# Altium schematic sheet Low_Pass_48kHz.SchDoc: Wprowadź Tytuł
size A4; CheckedBy: Wprowadź sprawdzającego; CompanyName: Politechnika Warszawska; DrawnBy: Wprowadź autora; Organization: Koło Naukowe Robotyków; Address1: Nowowiejska 24; Address2: 00-001; Address3: Warszawa; Address4: Polska; Revision: V*.*; DrawnDate: 10.10.20; CheckDate: 10.10.20; ProjectName: Nazwa Projektu
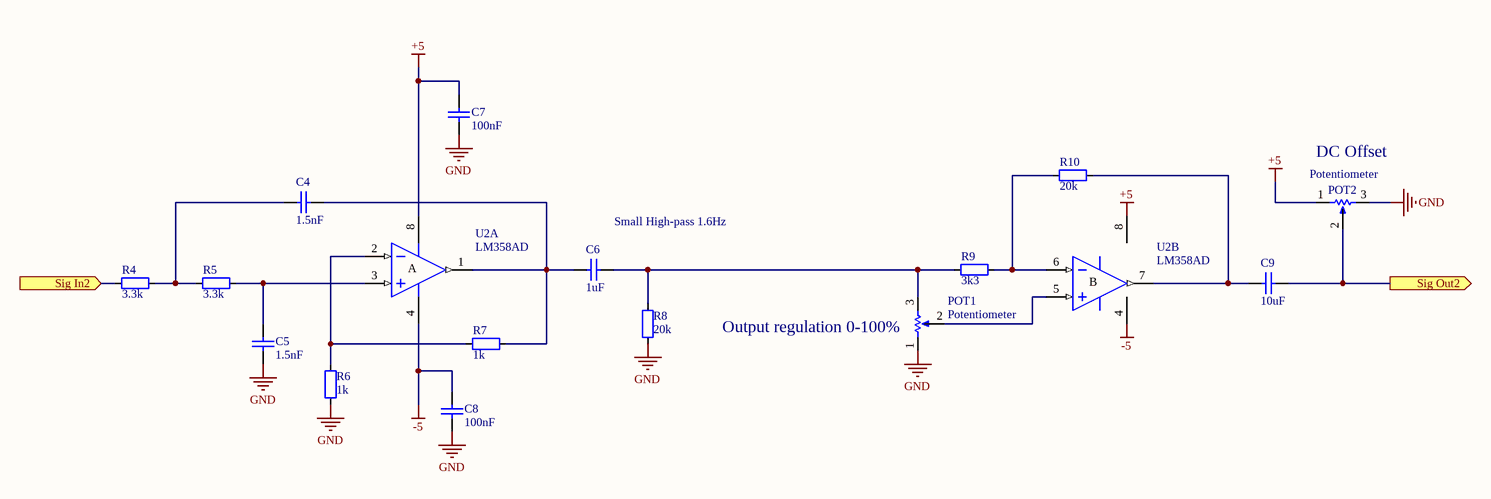
[diagram p0: Low_Pass_48kHz.SchDoc]

## Parts
C4  value 1.5nF  [CAPC0603M]  (hidden comment: Cap)
C5  value 1.5nF  [CAPC0603M]  (hidden comment: Cap)
C6  value 1uF  [CAPC0603M]  (hidden comment: Cap)
C7  value 100nF  [CAPC0603M]  (hidden comment: Cap)
C8  value 100nF  [CAPC0603M]  (hidden comment: Cap)
C9  value 10uF  [CAPC0603M]  (hidden comment: Cap)
POT1  Potentiometer  [Pot_3296]
POT2  Potentiometer  [Pot_3296]
R4  3.3k  [RESC0603]
R5  3.3k  [RESC0603]
R6  1k  [RESC0603]
R7  1k  [RESC0603]
R8  20k  [RESC0603]
R9  3k3  [RESC0603]
R10  20k  [RESC0603]
U2  LM358AD  [SO-8_N]  (parts A,B of 2)

## Ports
Sig In2 (in), Sig Out2 (out)

## Nets
+5: C7.1 POT2.1 U2.8(V+)
-5: C8.1 U2.4(V-)
GND: C5.1 C7.2 C8.2 POT1.1 POT2.3 R6.1 R8.1
Sig In2: R4.1 ; port Sig In2
Sig Out2: C9.1 POT2.2 ; port Sig Out2
NetC4_1: C4.1 C6.2 R7.2 U2.1(OUT)
NetC4_2: C4.2 R4.2 R5.1
NetC5_2: C5.2 R5.2 U2.3(IN+)
NetC6_1: C6.1 POT1.3 R8.2 R9.2
NetC9_2: C9.2 R10.1 U2.7(OUT)
NetPOT1_2: POT1.2 U2.5(IN+)
NetR6_2: R6.2 R7.1 U2.2(IN-)
NetR9_1: R9.1 R10.2 U2.6(IN-)

## Notes on the sheet
- (near POT2) DC Offset
- (near C6) Small High-pass 1.6Hz
- (near POT1) Output regulation 0-100%
- Project
- Rev.
- Title
- Drawn by
- Date
- Sheet
- of
- Checked by
- (in symbol LM358AD, part A) A
- (in symbol LM358AD, part B) B

## Library data of the parts
C4-C9 = Cap: Ceramic capacitor; Unit Price1: *; Unit Price2: *
R4-R10 = RES: Resistior
  R4 R5: Value: 3.3k
  R6 R7: Value: 1k
  R8 R10: Value: 20k
  R9: Value: 3k3
U2 = LM358AD: Low-Power Dual Operational Amplifier; Published: 24-Aug-2001; LatestRevisionDate: 13-Apr-2006; LatestRevisionNote: IPC-7351 Footprint Added.; DatasheetVersion: Jun-1998; PackageVersion: Dec-2002; PackageReference: SO8; Publisher: Altium Limited; PackageDescription: 8-Pin Small Outline Integrated Circuit 1.27 mm Pitch; Code_JEDEC: MS-012-AA; Code_IPC: SOIC127P600-8; ComponentLink1Description: Manufacturer Link; ComponentLink1URL: http://www.st.com/; ComponentLink2Description: Datasheet; ComponentLink2URL: http://www.st.com/stonline/products/literature/ds/2163/lm358.pdf